# Altium project Byggern_Gruppe11_PCB_rev1.PrjPcb
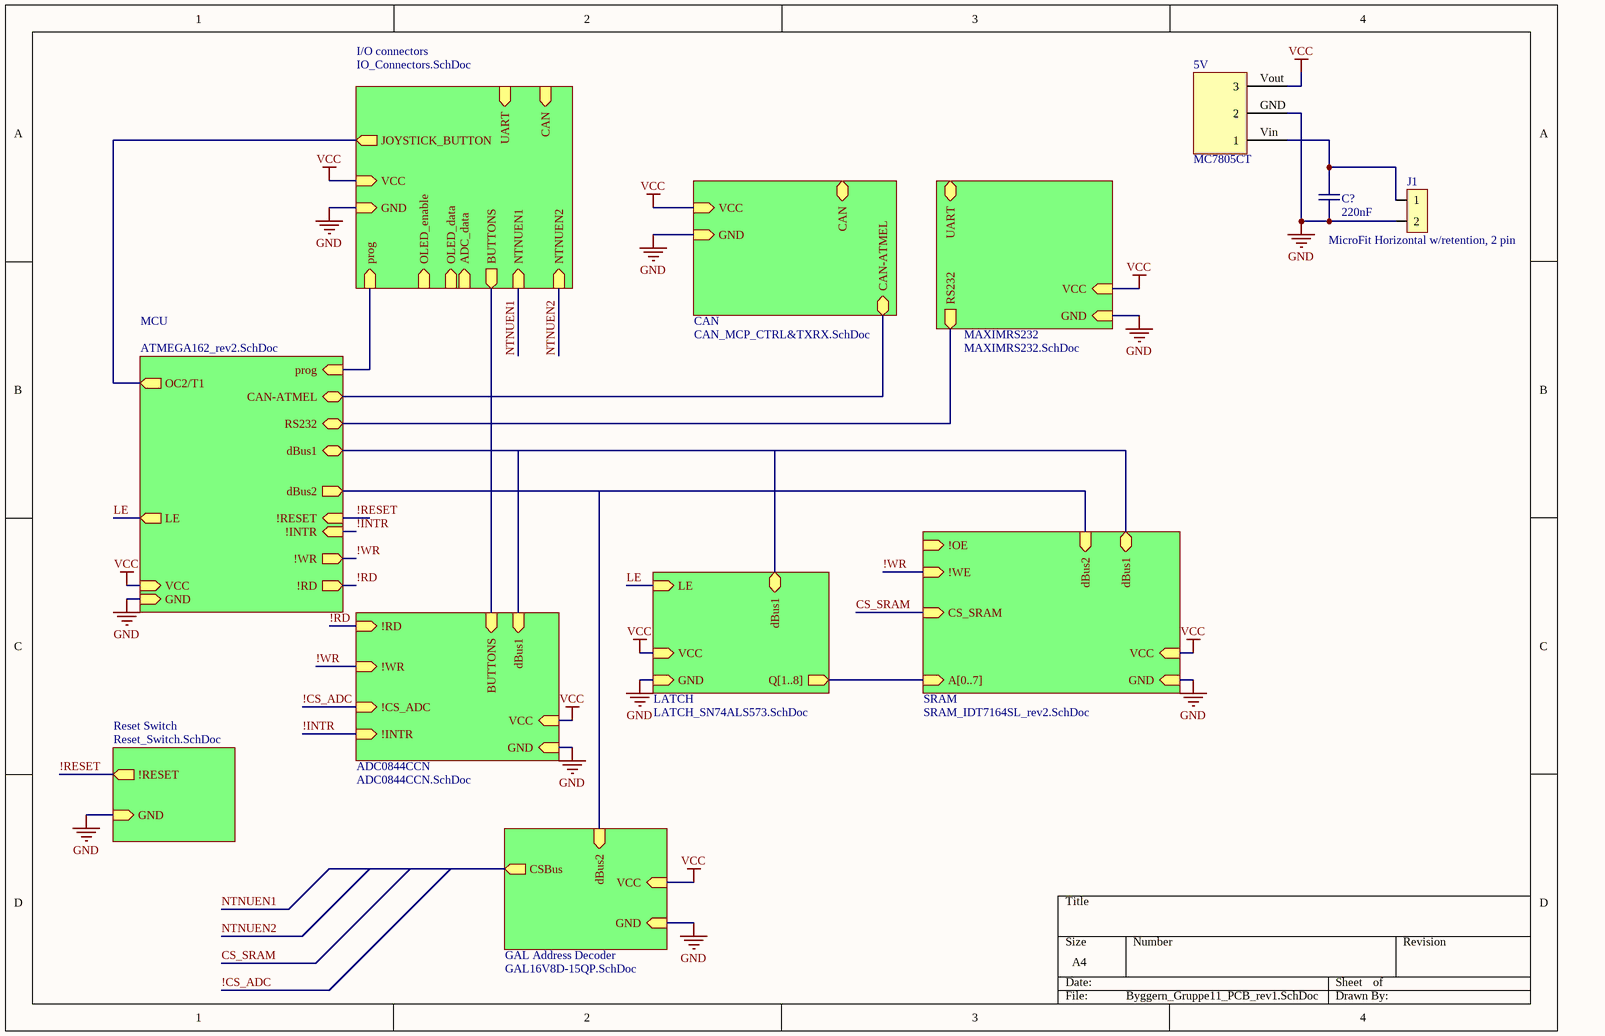
[diagram p0: Byggern_Gruppe11_PCB_rev1.SchDoc]
10 sheets, 28 parts. Net scope: hierarchical (ports join the sheet entries above them; power ports are global).
Sheets:
  Byggern_Gruppe11_PCB_rev1.SchDoc
    MCU = ATMEGA162_rev2.SchDoc
    LATCH = LATCH_SN74ALS573.SchDoc
    SRAM = SRAM_IDT7164SL_rev2.SchDoc
    CAN = CAN_MCP_CTRL&TXRX.SchDoc
    Reset Switch = Reset_Switch.SchDoc
    GAL Address Decoder = GAL16V8D-15QP.SchDoc
    ADC0844CCN = ADC0844CCN.SchDoc
    MAXIMRS232 = MAXIMRS232.SchDoc
    I/O connectors = IO_Connectors.SchDoc

## Sheet Byggern_Gruppe11_PCB_rev1.SchDoc
size A4

### Parts
(Parts that share a designator on the sheet are numbered #1, #2 ... from top to bottom, then left to right.)
5V  MC7805CT  [MC7805CT_5V]
C?#1  220nF  [CAPC0603(1608)55_N]
J1  MicroFit Horizontal w/retention, 2 pin  [PCBComponent]

### Sub-sheets
ADC0844CCN = ADC0844CCN.SchDoc: GND (in), !RD (in), dBus1 (in), !WR (in), !CS_ADC (in), VCC (in), !INTR (in), BUTTONS (in)
CAN = CAN_MCP_CTRL&TXRX.SchDoc: GND (in), VCC (in), CAN-ATMEL, CAN (bidir)
GAL Address Decoder = GAL16V8D-15QP.SchDoc: CSBus (out), dBus2 (in), GND (in), VCC (in)
I/O connectors = IO_Connectors.SchDoc: OLED_enable (in), CAN (in), VCC (in), prog (in), GND (in), OLED_data (in), ADC_data (in), UART (in), NTNUEN1 (in), NTNUEN2 (in), BUTTONS (out), JOYSTICK_BUTTON (out)
LATCH = LATCH_SN74ALS573.SchDoc: GND (in), dBus1 (bidir), VCC (in), Q[1..8] (out), LE (in)
MAXIMRS232 = MAXIMRS232.SchDoc: VCC (in), GND (in), RS232 (out), UART
MCU = ATMEGA162_rev2.SchDoc: dBus1 (bidir), VCC (in), GND (in), !RESET (in), !RD (out), dBus2 (out), prog (in), !INTR (in), !WR (out), CAN-ATMEL (bidir), OC2/T1 (out), RS232 (bidir), LE (out)
Reset Switch = Reset_Switch.SchDoc: !RESET (out), GND (in)
SRAM = SRAM_IDT7164SL_rev2.SchDoc: A[0..7] (in), dBus1 (bidir), !OE (in), dBus2 (in), !WE (in), VCC (in), GND (in), CS_SRAM (in)

### Nets
GND: 5V.GND(2) C?#1.1 J1.2 ; sheet MCU/GND, sheet LATCH/GND, sheet SRAM/GND, sheet CAN/GND, sheet Reset Switch/GND, sheet GAL Address Decoder/GND, sheet ADC0844CCN/GND, sheet MAXIMRS232/GND, sheet I/O connectors/GND
VCC: 5V.Vout(3) ; sheet MCU/VCC, sheet LATCH/VCC, sheet SRAM/VCC, sheet CAN/VCC, sheet GAL Address Decoder/VCC, sheet ADC0844CCN/VCC, sheet MAXIMRS232/VCC, sheet I/O connectors/VCC
!CS_ADC: sheet ADC0844CCN/!CS_ADC
!INTR: sheet MCU/!INTR, sheet ADC0844CCN/!INTR
!RD: sheet MCU/!RD, sheet ADC0844CCN/!RD
!RESET: sheet MCU/!RESET, sheet Reset Switch/!RESET
!WR: sheet MCU/!WR, sheet SRAM/!WE, sheet ADC0844CCN/!WR
LE: sheet MCU/LE, sheet LATCH/LE
NTNUEN1: sheet I/O connectors/NTNUEN1
NTNUEN2: sheet I/O connectors/NTNUEN2
Net5V_Vin: 5V.Vin(1) C?#1.2 J1.1
NetU?#1_2: sheet MCU/OC2/T1, sheet I/O connectors/JOYSTICK_BUTTON

### Buses and harness runs
bus sheet ADC0844CCN/BUTTONS = sheet I/O connectors/BUTTONS
bus sheet ADC0844CCN/dBus1 = sheet LATCH/dBus1 = sheet MCU/dBus1 = sheet SRAM/dBus1
bus sheet CAN/CAN-ATMEL = sheet MCU/CAN-ATMEL
bus sheet GAL Address Decoder/dBus2 = sheet MCU/dBus2 = sheet SRAM/dBus2
bus sheet I/O connectors/prog = sheet MCU/prog
bus sheet LATCH/Q[1..8] = sheet SRAM/A[0..7]
bus sheet MAXIMRS232/RS232 = sheet MCU/RS232

### Library data of the parts
5V = MC7805CT: MC7805CT 5V Linear Regulator
C?#1 = 3934: Capacitor; id: 3934; pakke_opprettet_av: 815; pris: 0; nokkelord: kondensator; pakketype: 0603; pakke_opprettet: 18.02.2015 14:18:13; symbol_opprettet_av: 815; symbol_opprettet: 14.11.2014 20:19:34; navn: 220nF
J1 = CMP-001-E66-5: micro-fit two pin horizontal dual row

## Sheet ATMEGA162_rev2.SchDoc
size A4
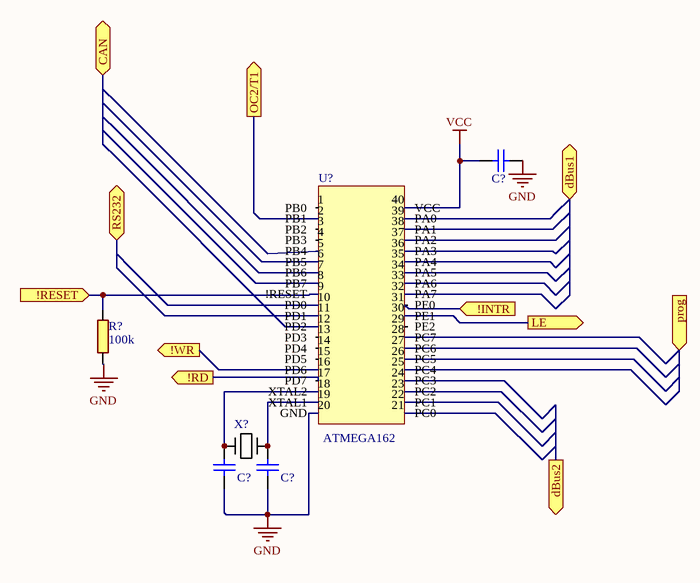
[diagram p1: ATMEGA162_rev2.SchDoc]

### Parts
(Parts that share a designator on the sheet are numbered #1, #2 ... from top to bottom, then left to right.)
C?#2  0603 Cap  [0603 Capacitor]  (value not drawn)
C?#3  0603 Cap  [0603 Capacitor]  (value not drawn)
C?#4  0603 Cap  [0603 Capacitor]  (value not drawn)
R?#1  100k  [RESC0603(1608)_N]
U?#1  ATMEGA162  [PCBComponent_1]
X?#1  ABM3-16.000MHZ-D2Y-T  [CRYSTAL-ABM7]  (value not drawn)

### Ports
!INTR (in), !RD (out), !RESET (in), !WR (out), CAN (bidir), dBus1 (bidir), dBus2 (out), LE (out), OC2/T1 (out), prog (in), RS232 (bidir)

### Nets
GND: C?#2.1 C?#3.2 C?#4.2 R?#1.1 U?#1.20(GND)
VCC: C?#2.2 U?#1.40(VCC)
!INTR: U?#1.31(PE0) ; port !INTR
!RD: U?#1.17(PD7) ; port !RD
!RESET: R?#1.2 U?#1.9(!RESET) ; port !RESET
!WR: U?#1.16(PD6) ; port !WR
LE: U?#1.30(PE1) ; port LE
NetC?#3_1: C?#3.1 U?#1.18(XTAL2) X?#1.1
NetC?#4_1: C?#4.1 U?#1.19(XTAL1) X?#1.2
NetU?#1_2: U?#1.2(PB1) ; port OC2/T1

Not connected (* = marked no-connect by the designer): U?#1 1(PB0) 3(PB2) 4(PB3) 5(PB4) 6(PB5) 7(PB6) 8(PB7) 10(PD0) 11(PD1) 12(PD2) 13(PD3) 14(PD4) 15(PD5) 21(PC0) 22(PC1) 23(PC2) 24(PC3) 25(PC4) 26(PC5) 27(PC6) 28(PC7) 29(PE2) 32(PA7) 33(PA6) 34(PA5) 35(PA4) 36(PA3) 37(PA2) 38(PA1) 39(PA0)

### Library data of the parts
C?#2-C?#4 = CMP-001-A20-6: value: *
R?#1 = 2384: 0.1W 1% Thick film resistor; id: 2384; rad: -1; rom: OV; lager_type: Fremlager; dybde: 96; hylle: 2; antall: 100; kolonne: 0; pakke_opprettet_av: 815; pakketype: 0603; pakke_opprettet: 08.07.2014 21:15:30; symbol_opprettet_av: 815; symbol_opprettet: 08.07.2014 21:16:33; navn: 100k; pris: 0; nokkelord: Resistor
U?#1 = Component_1: AVR ATMEGA162
X?#1 = 4474: id: 4474; rad: 2; rom: OV; lager_type: Fremlager; dybde: 4; hylle: 7; antall: 10; pakke_opprettet_av: 774; beskrivelse: Krystall 16MHz 18pF, 5*3.2,  ABM3, 30ppm; leverandor_varenr: 2467791; nokkelord: Krystall 16MHz 18pF  ABM3,30ppm 16 MHz; leverandor: Farnell; pakketype: SMD; pakke_opprettet: 23.08.2014 20:10:40; symbol_opprettet_av: 774; symbol_opprettet: 23.08.2014 20:23:20; navn: ABM3-16.000MHZ-D2Y-T; pris: 10

## Sheet LATCH_SN74ALS573.SchDoc
size A4
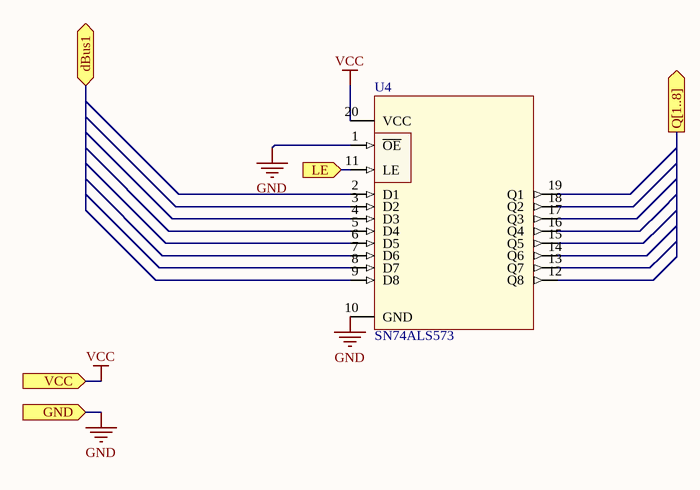
[diagram p2: LATCH_SN74ALS573.SchDoc]

### Parts
U4  SN74ALS573  [PLASTIC_DIP20]

### Ports
dBus1 (bidir), GND (in), LE (in), Q[1..8] (out), VCC (in)

### Nets
GND: U4.1(~{OE}) U4.10(GND) ; port GND
VCC: U4.20(VCC) ; port VCC
LE: U4.11(LE) ; port LE

Not connected (* = marked no-connect by the designer): U4 2(D1) 3(D2) 4(D3) 5(D4) 6(D5) 7(D6) 8(D7) 9(D8) 12(Q8) 13(Q7) 14(Q6) 15(Q5) 16(Q4) 17(Q3) 18(Q2) 19(Q1)

### Library data of the parts
U4 = 4154: id: 4154; rad: 11; rom: GM; lager_type: Baklager; dybde: 9; hylle: 750; antall: 60; kolonne: 0; pakke_opprettet_av: 1154; symbol_opprettet_av: 1855; navn: SN74HC573AN; pris: 5; nokkelord: 74, sn74; pakke_opprettet: 11.10.2016 16:46:43; symbol_opprettet: 26.09.2018 10:49:10

## Sheet SRAM_IDT7164SL_rev2.SchDoc
size A4
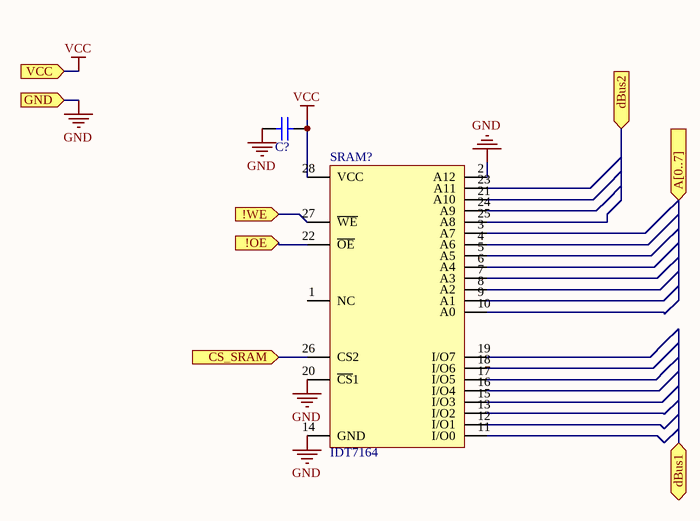
[diagram p3: SRAM_IDT7164SL_rev2.SchDoc]

### Parts
(Parts that share a designator on the sheet are numbered #1, #2 ... from top to bottom, then left to right.)
C?#5  0603 Cap  [0603 Capacitor]  (value not drawn)
SRAM?  IDT7164  [PDIP28]

### Ports
!OE (in), !WE (in), A[0..7] (in), CS_SRAM (in), dBus1 (bidir), dBus2 (in), GND (in), VCC (in)

### Nets
GND: C?#5.2 SRAM?.2(A12) SRAM?.14(GND) SRAM?.20(~{CS}1) ; port GND
VCC: C?#5.1 SRAM?.28(VCC) ; port VCC
!WR: SRAM?.27(~{WE}) ; port !WE
CS_SRAM: SRAM?.26(CS2) ; port CS_SRAM
NetSRAM?_22: SRAM?.22(~{OE}) ; port !OE

Not connected (* = marked no-connect by the designer): SRAM? 1(NC) 3(A7) 4(A6) 5(A5) 6(A4) 7(A3) 8(A2) 9(A1) 10(A0) 11(I/O0) 12(I/O1) 13(I/O2) 15(I/O3) 16(I/O4) 17(I/O5) 18(I/O6) 19(I/O7) 21(A10) 23(A11) 24(A9) 25(A8)

### Library data of the parts
C?#5 = CMP-001-A20-6: value: *
SRAM? = 4509: id: 4509; pakke_opprettet_av: 1154; symbol_opprettet_av: 1855; beskrivelse: CMOS Static RAM 64K (8K x 8-Bit); pris: 0; nokkelord: SRAM Byggern; pakke_opprettet: 11.10.2016 17:43:12; symbol_opprettet: 13.09.2018 17:29:18; navn: IDT7164

## Sheet CAN_MCP_CTRL&TXRX.SchDoc
size A4
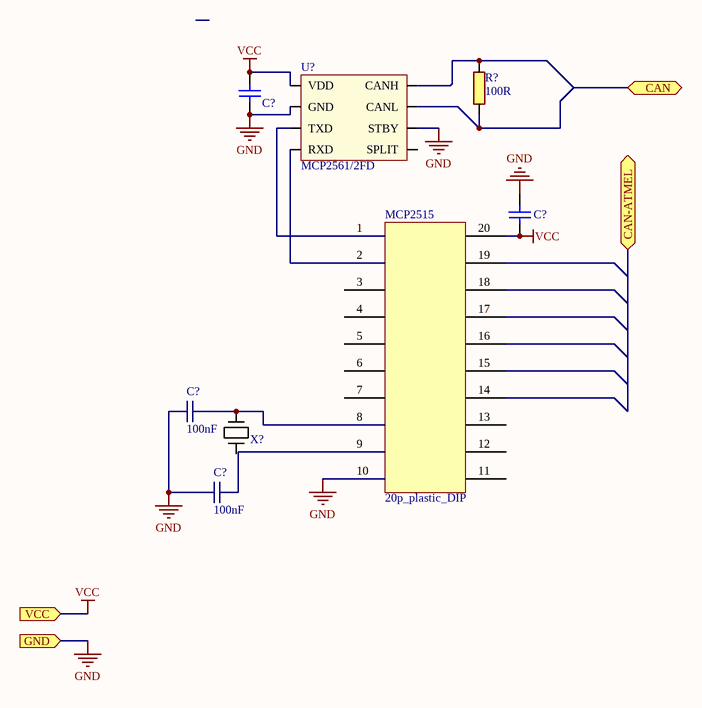
[diagram p4: CAN_MCP_CTRL&TXRX.SchDoc]

### Parts
(Parts that share a designator on the sheet are numbered #1, #2 ... from top to bottom, then left to right.)
C?#6  0603 Cap  [0603 Capacitor]  (value not drawn)
C?#7  0603 Cap  [0603 Capacitor]  (value not drawn)
C?#8  100nF  [CAPC0603(1608)55_N]
C?#9  100nF  [CAPC0603(1608)55_N]
MCP2515  20p_plastic_DIP  [20p_plastic_DIP]
R?#2  100R  [RESC0603(1608)_N]
U?#2  MCP2561/2FD  [SOIC127P600X175-8N]
X?#2  ABM3-16.000MHZ-D2Y-T  [CRYSTAL-ABM7]  (value not drawn)

### Ports
CAN (bidir), CAN-ATMEL, GND (in), VCC (in)

### Nets
GND: C?#6.2 C?#7.1 C?#8.2 C?#9.2 MCP2515.10 U?#2.2(GND) U?#2.8(STBY) ; port GND
VCC: C?#6.1 C?#7.2 MCP2515.20 U?#2.3(VDD) ; port VCC
NetC?#8_1: C?#8.1 MCP2515.8 X?#2.2
NetC?#9_1: C?#9.1 MCP2515.9
NetMCP2515_1: MCP2515.1 U?#2.1(TXD)
NetMCP2515_2: MCP2515.2 U?#2.4(RXD)
NetR?#2_1: R?#2.1 U?#2.6(CANL)
NetR?#2_2: R?#2.2 U?#2.7(CANH)

Not connected (* = marked no-connect by the designer): MCP2515 3 4 5 6 7 11 12 13 14 15 16 17 18 19; U?#2 5(SPLIT); X?#2 1

### Library data of the parts
C?#6 C?#7 = CMP-001-A20-6: value: *
C?#8 C?#9 = 3934: Capacitor; id: 3934; pakke_opprettet_av: 815; navn: 220nF; pris: 0; nokkelord: kondensator; pakketype: 0603; pakke_opprettet: 18.02.2015 14:18:13; symbol_opprettet_av: 815; symbol_opprettet: 14.11.2014 20:19:34
R?#2 = 2384: 0.1W 1% Thick film resistor; id: 2384; rad: -1; rom: OV; lager_type: Fremlager; dybde: 96; hylle: 2; antall: 100; kolonne: 0; pakke_opprettet_av: 815; navn: 100k; pakketype: 0603; pakke_opprettet: 08.07.2014 21:15:30; symbol_opprettet_av: 815; symbol_opprettet: 08.07.2014 21:16:33; pris: 0; nokkelord: Resistor
U?#2 = CMP-001-D35-2: CAN tranciever with CAN-FD optimization,  microchip technology
X?#2 = 4474: as X?#1 on sheet ATMEGA162_rev2; pakke_opprettet: 23.08.2014 20:10:40; symbol_opprettet_av: 774; symbol_opprettet: 23.08.2014 20:23:20; navn: ABM3-16.000MHZ-D2Y-T; pris: 10

## Sheet Reset_Switch.SchDoc
size A4
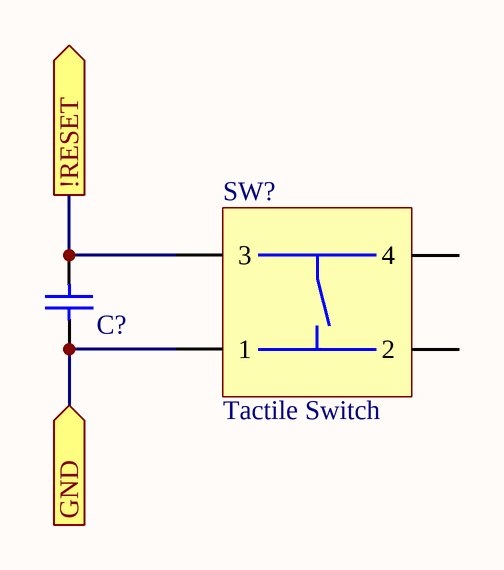
[diagram p5: Reset_Switch.SchDoc]

### Parts
(Parts that share a designator on the sheet are numbered #1, #2 ... from top to bottom, then left to right.)
C?#10  0603 Cap  [0603 Capacitor]  (value not drawn)
SW?  Tactile Switch  [PCBComponent]

### Ports
!RESET (out), GND (in)

### Nets
GND: C?#10.1 SW?.1 ; port GND
!RESET: C?#10.2 SW?.3 ; port !RESET

Not connected (* = marked no-connect by the designer): SW? 2 4

### Library data of the parts
C?#10 = CMP-001-A20-6: value: *
SW? = CMP-001-E74-5: Tactile Switch, 24V, 50 mA, Pushbutton - N.O, 2-1437565-8

## Sheet GAL16V8D-15QP.SchDoc
size A4
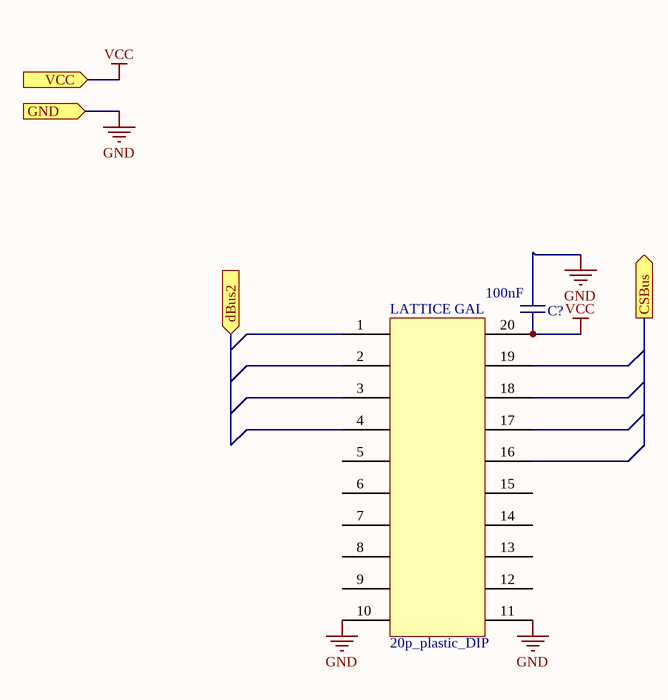
[diagram p6: GAL16V8D-15QP.SchDoc]

### Parts
(Parts that share a designator on the sheet are numbered #1, #2 ... from top to bottom, then left to right.)
C?#11  100nF  [CAPC0603(1608)55_N]
LATTICE_GAL  20p_plastic_DIP

### Ports
CSBus (out), dBus2 (in), GND (in), VCC (in)

### Nets
GND: C?#11.2 LATTICE_GAL.11 ; port GND
VCC: C?#11.1 LATTICE_GAL.20 ; port VCC

Not connected (* = marked no-connect by the designer): LATTICE_GAL 1 2 3 4 5 6 7 8 9 10 12 13 14 15 16 17 18 19

### Notes on the sheet
- Labels drawn without touching a wire or pin: GND

### Library data of the parts
C?#11 = 3934: as C?#8 on sheet CAN_MCP_CTRL&TXRX; pakke_opprettet: 18.02.2015 14:18:13; symbol_opprettet_av: 815; symbol_opprettet: 14.11.2014 20:19:34

## Sheet ADC0844CCN.SchDoc
size A4
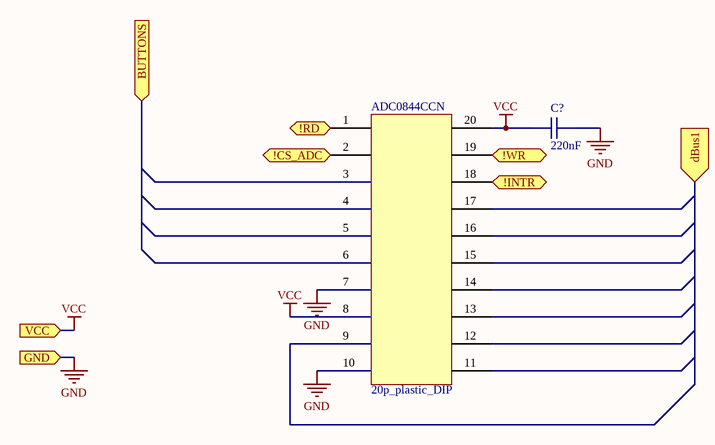
[diagram p7: ADC0844CCN.SchDoc]

### Parts
(Parts that share a designator on the sheet are numbered #1, #2 ... from top to bottom, then left to right.)
ADC0844CCN  20p_plastic_DIP
C?#12  220nF  [CAPC0603(1608)55_N]

### Ports
!CS_ADC (in), !INTR (in), !RD (in), !WR (in), BUTTONS (in), dBus1 (in), GND (in), VCC (in)

### Nets
GND: ADC0844CCN.7 ADC0844CCN.10 C?#12.1 ; port GND
VCC: ADC0844CCN.8 ADC0844CCN.20 C?#12.2 ; port VCC
!INTR: ADC0844CCN.18 ; port !INTR
!WR: ADC0844CCN.19 ; port !WR

Not connected (* = marked no-connect by the designer): ADC0844CCN 1 2 3 4 5 6 9 11 12 13 14 15 16 17

### Library data of the parts
C?#12 = 3934: as C?#1 on sheet Byggern_Gruppe11_PCB_rev1; pakke_opprettet: 18.02.2015 14:18:13; symbol_opprettet_av: 815; symbol_opprettet: 14.11.2014 20:19:34; navn: 220nF

## Sheet MAXIMRS232.SchDoc
size A4
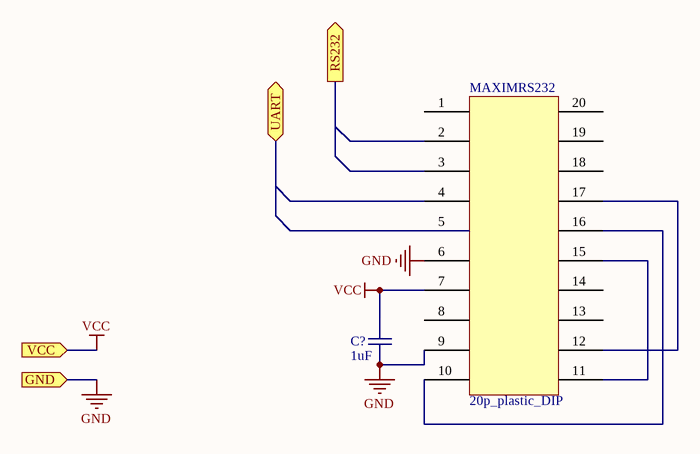
[diagram p8: MAXIMRS232.SchDoc]

### Parts
(Parts that share a designator on the sheet are numbered #1, #2 ... from top to bottom, then left to right.)
C?#13  1uF  [CAPC0603(1608)55_N]
MAXIMRS232  20p_plastic_DIP  [20p_plastic_DIP]

### Ports
GND (in), RS232 (out), UART, VCC (in)

### Nets
GND: C?#13.1 ; port GND
VCC: C?#13.2 ; port VCC
NetMAXIMRS232_11: MAXIMRS232.11 MAXIMRS232.15
NetMAXIMRS232_12: MAXIMRS232.12 MAXIMRS232.17

Not connected (* = marked no-connect by the designer): MAXIMRS232 1 2 3 4 5 6 7 8 9 10 13 14 16 18 19 20

### Notes on the sheet
- Labels drawn without touching a wire or pin: GND

### Library data of the parts
C?#13 = 3934: as C?#8 on sheet CAN_MCP_CTRL&TXRX; pakke_opprettet: 18.02.2015 14:18:13; symbol_opprettet_av: 815; symbol_opprettet: 14.11.2014 20:19:34

## Sheet IO_Connectors.SchDoc
size A4
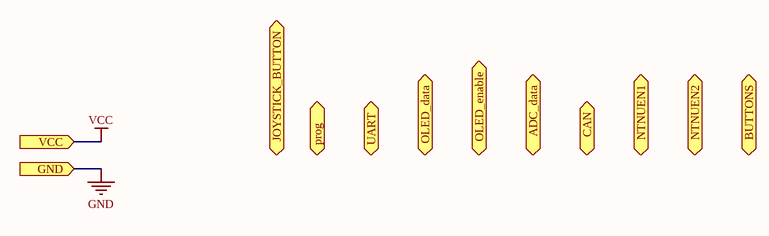
[diagram p9: IO_Connectors.SchDoc]

### Ports
ADC_data (in), BUTTONS (out), CAN (in), GND (in), JOYSTICK_BUTTON (out), NTNUEN1 (in), NTNUEN2 (in), OLED_data (in), OLED_enable (in), prog (in), UART (in), VCC (in)

## Nets that join several sheets
GND: Byggern_Gruppe11_PCB_rev1 (5V.GND C?#1.1 J1.2), ATMEGA162_rev2 (5 pins), LATCH_SN74ALS573 (U4.1 U4.10), SRAM_IDT7164SL_rev2 (C?#5.2 SRAM?.2 SRAM?.14 SRAM?.20), CAN_MCP_CTRL&TXRX (7 pins), Reset_Switch (C?#10.1 SW?.1), GAL16V8D-15QP (C?#11.2 LATTICE_GAL.11), ADC0844CCN (ADC0844CCN.7 ADC0844CCN.10 C?#12.1), MAXIMRS232 (C?#13.1)
VCC: Byggern_Gruppe11_PCB_rev1 (5V.Vout), ATMEGA162_rev2 (C?#2.2 U?#1.40), LATCH_SN74ALS573 (U4.20), SRAM_IDT7164SL_rev2 (C?#5.1 SRAM?.28), CAN_MCP_CTRL&TXRX (C?#6.1 C?#7.2 MCP2515.20 U?#2.3), GAL16V8D-15QP (C?#11.1 LATTICE_GAL.20), ADC0844CCN (ADC0844CCN.8 ADC0844CCN.20 C?#12.2), MAXIMRS232 (C?#13.2)
!INTR: ATMEGA162_rev2 (U?#1.31), ADC0844CCN (ADC0844CCN.18)
!RESET: ATMEGA162_rev2 (R?#1.2 U?#1.9), Reset_Switch (C?#10.2 SW?.3)
!WR: ATMEGA162_rev2 (U?#1.16), SRAM_IDT7164SL_rev2 (SRAM?.27), ADC0844CCN (ADC0844CCN.19)
LE: ATMEGA162_rev2 (U?#1.30), LATCH_SN74ALS573 (U4.11)